# Altium schematic sheet 15-DistanceSRF05.SchDoc
size A4
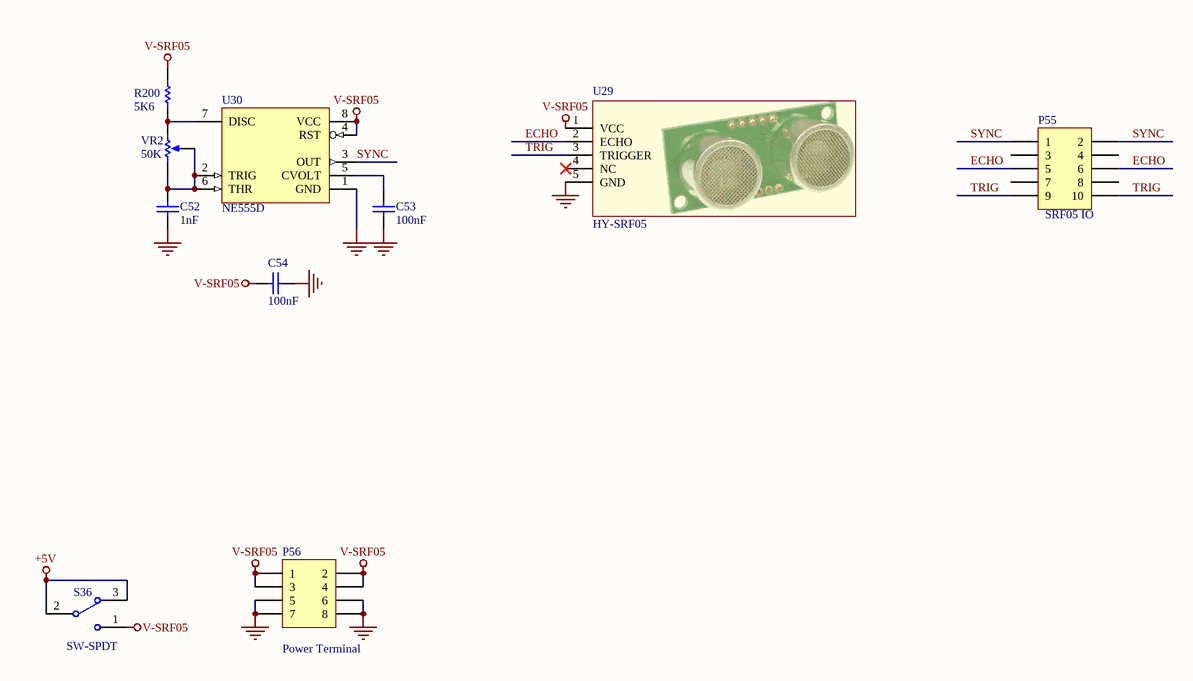
[diagram p0: 15-DistanceSRF05.SchDoc]

## Parts
C52  value 1nF  [c-0805]  (hidden comment: 102)
C53  value 100nF  [c-0805]  (hidden comment: 104)
C54  value 100nF  [c-0805]  (hidden comment: 104)
P55  value SRF05 IO  [HDR2X5]  (hidden comment: Header 5X2)
P56  Publisher: Power Terminal  [HDR2X4]  (hidden comment: Header 4X2)
R200  value 5K6  [R-0805]  (hidden comment: 562)
S36  SW-SPDT  [SW-DIP1SMD]
U29  HY-SRF05  [SRF-05]
U30  NE555D  [DIP8]
VR2  50K  [VR1]

## Nets
+5V: S36.2 S36.3
GND: C52.1 C53.1 C54.1 P56.5 P56.6 P56.7 P56.8 U29.5(GND) U30.1(GND)
V-SRF05: C54.2 P56.1 P56.2 P56.3 P56.4 R200.2 S36.1 U29.1(VCC) U30.4(RST) U30.8(VCC)
ECHO: P55.5 P55.6 U29.2(ECHO)
SYNC: P55.1 P55.2 U30.3(OUT)
TRIG: P55.9 P55.10 U29.3(TRIGGER)
NetC52_2: C52.2 U30.2(TRIG) U30.6(THR) VR2.1(TOP) VR2.2(TAP)
NetC53_2: C53.2 U30.5(CVOLT)
NetR200_1: R200.1 U30.7(DISC) VR2.3(BOT)

Not connected (* = marked no-connect by the designer): P55 3 4 7 8; U29 4(NC)*

## Library data of the parts
C52-C54 = Cap: Capacitor; Published: 8-Jun-2000; LatestRevisionDate: 17-Jul-2002; LatestRevisionNote: Re-released for DXP Platform.; PackageReference: RAD-0.3; Publisher: Altium Limited
P55 = Header 5X2: Header, 5-Pin, Dual row; LatestRevisionDate: 17-Jul-2002; LatestRevisionNote: Re-released for DXP Platform.
P56 = Header 4X2: Header, 4-Pin, Dual row; LatestRevisionDate: 17-Jul-2002; LatestRevisionNote: Re-released for DXP Platform.
R200 = Res1: Resistor; Published: 8-Jun-2000; LatestRevisionDate: 17-Jul-2002; LatestRevisionNote: Re-released for DXP Platform.; PackageReference: AXIAL-0.3; Publisher: Altium Limited
S36 = SW-SPDT: SPDT Subminiature Toggle Switch, Right Angle Mounting, Vertical Actuation; Published: 24-Mar-1999; LatestRevisionDate: 17-Dec-2003; LatestRevisionNote: Schematic revised, PCB Footprint replaced.; DatasheetVersion: 05-Dec-2000; PackageReference: TL36WW15050; Publisher: Altium Limited; PackageDescription: Switch; 4 Leads; ComponentLink1Description: Manufacturer Link; ComponentLink1URL: http://www.apem.com
U30 = NE555D: General-Purpose Single Bipolar Timer; Published: 24-Aug-2001; LatestRevisionDate: 13-Apr-2006; LatestRevisionNote: IPC-7351 Footprint Added.; DatasheetVersion: Jul-1998; PackageVersion: Dec-2002; PackageReference: SO8; Publisher: Altium Limited; PackageDescription: 8-Pin Small Outline Integrated Circuit 1.27 mm Pitch; Code_JEDEC: MS-012-AA; Code_IPC: SOIC127P600-8; ComponentLink1Description: Manufacturer Link; ComponentLink1URL: http://www.st.com/; ComponentLink2Description: Datasheet; ComponentLink2URL: http://www.st.com/stonline/products/literature/ds/2182/ne555.pdf
VR2 = RPot: Potentiometer; Sim Note: Enter the Resistance value and the set point into parameter fields.; Set Position: 0.5; Published: 8-Jun-2000; LatestRevisionDate: 17-Jul-2002; LatestRevisionNote: Re-released for DXP Platform.; PackageReference: VR5; Publisher: Altium Limited; Value: 50K